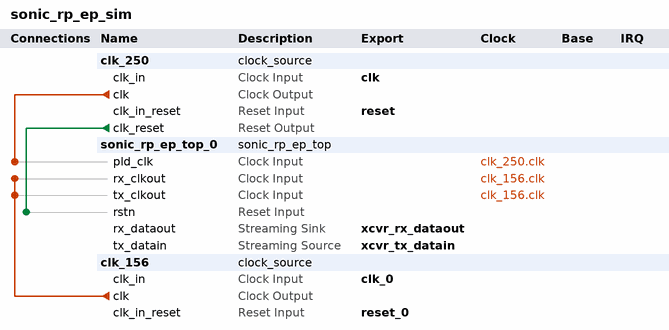
[diagram p0: system contents]
# Platform Designer (Qsys) system sonic_rp_ep_sim
# Parameters at their usual value, and those the tool derives, are not listed.
package require -exact qsys 11.0
create_system sonic_rp_ep_sim
set_project_property DEVICE_FAMILY STRATIXIV

add_instance clk_250 clock_source 11.0
set_instance_parameter_value clk_250 clockFrequency 250000000

add_instance sonic_rp_ep_top_0 sonic_rp_ep_top 1.0

add_instance clk_156 clock_source 11.0
set_instance_parameter_value clk_156 clockFrequency 156000000

# connections
add_connection clk_156.clk sonic_rp_ep_top_0.rx_clkout clock
add_connection clk_156.clk sonic_rp_ep_top_0.tx_clkout clock
add_connection clk_250.clk sonic_rp_ep_top_0.pld_clk clock
add_connection clk_250.clk_reset sonic_rp_ep_top_0.rstn reset

# exported interfaces
add_interface clk clock sink
set_interface_property clk EXPORT_OF clk_250.clk_in
add_interface reset reset sink
set_interface_property reset EXPORT_OF clk_250.clk_in_reset
add_interface clk_0 clock sink
set_interface_property clk_0 EXPORT_OF clk_156.clk_in
add_interface reset_0 reset sink
set_interface_property reset_0 EXPORT_OF clk_156.clk_in_reset
add_interface xcvr_tx_datain avalon_streaming source
set_interface_property xcvr_tx_datain EXPORT_OF sonic_rp_ep_top_0.tx_datain
add_interface xcvr_rx_dataout avalon_streaming sink
set_interface_property xcvr_rx_dataout EXPORT_OF sonic_rp_ep_top_0.rx_dataout

save_system sonic_rp_ep_sim.qsys
